# Altium schematic sheet Power.SchDoc
size A
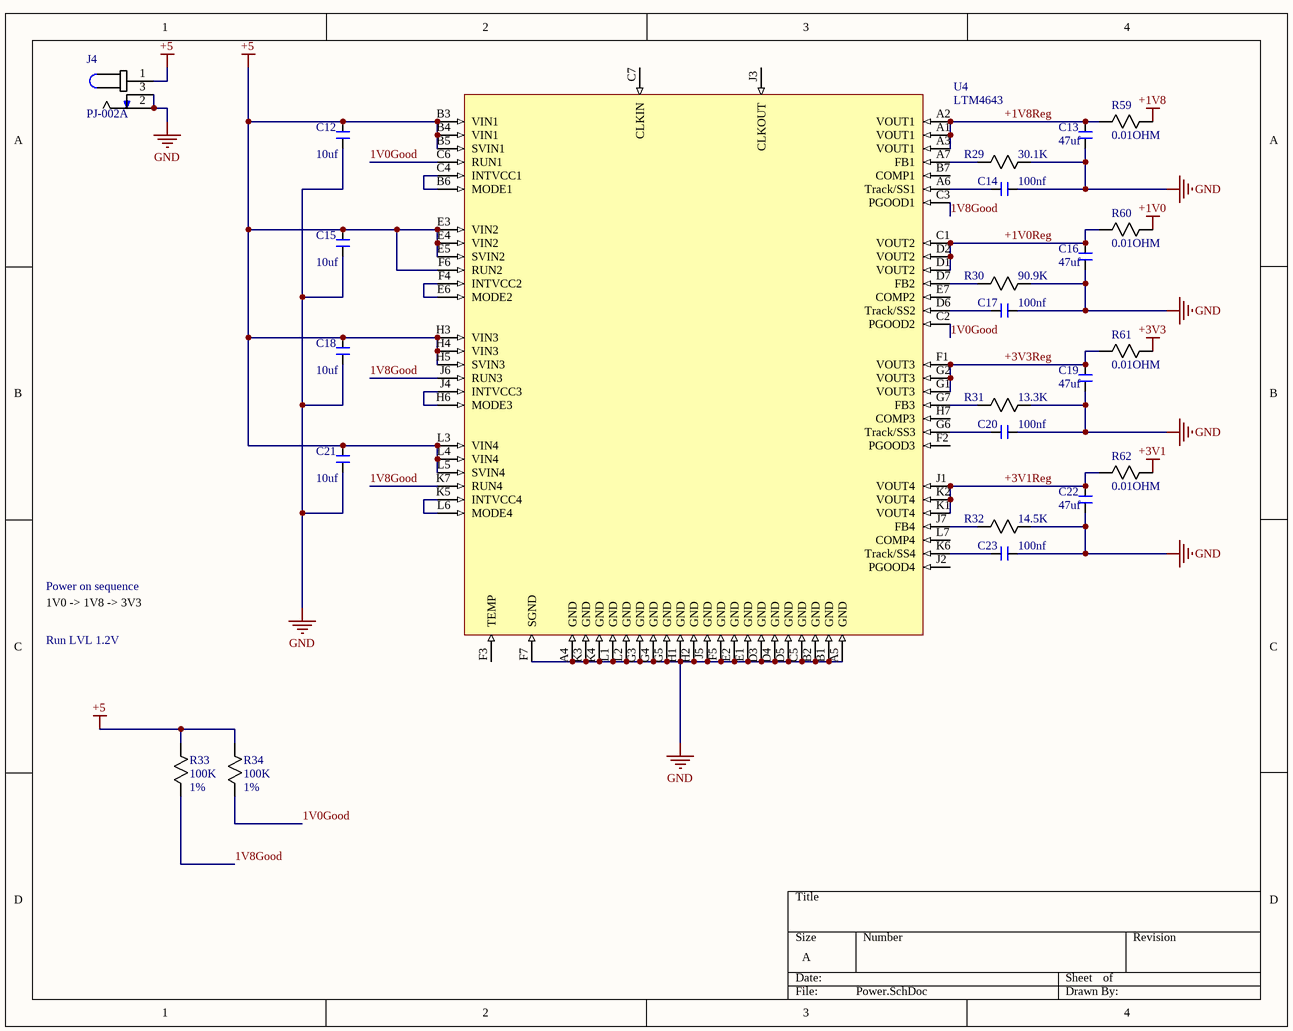
[diagram p0: Power.SchDoc]

## Parts
C12  10uf  [0402Footprint]
C13  47uf  [0805FOOTPRINT]
C14  100nf  [0402Footprint]
C15  10uf  [0402Footprint]
C16  47uf  [0805FOOTPRINT]
C17  100nf  [0402Footprint]
C18  10uf  [0402Footprint]
C19  47uf  [0805FOOTPRINT]
C20  100nf  [0402Footprint]
C21  10uf  [0402Footprint]
C22  47uf  [0805FOOTPRINT]
C23  100nf  [0402Footprint]
J4  PJ-002A  [CUI_PJ-002A]
R29  30.1K  [RES_CRCW_0402]
R30  90.9K  [RES_CRCW_0402]
R31  13.3K  [RES_CRCW_0402]
R32  14.5K  [RES_CRCW_0402]
R33  100K  Tolerance: 1%  [RES_CRCW_0402]
R34  100K  Tolerance: 1%  [RES_CRCW_0402]
R59  0.01OHM  [RESC1508X06N]
R60  0.01OHM  [RESC1508X06N]
R61  0.01OHM  [RESC1508X06N]
R62  0.01OHM  [RESC1508X06N]
U4  LTM4643  [LTM4643 15X9X2.42 05-08-1908]

## Nets
+1V0: R60.1
+1V8: R59.1
+3V1: R62.1
+3V3: R61.1
+5: C12.1 C15.1 C18.1 C21.1 J4.1 R33.1 R34.1 U4.B3(VIN1) U4.B4(VIN1) U4.B5(SVIN1) U4.E3(VIN2) U4.E4(VIN2) U4.E5(SVIN2) U4.F6(RUN2) U4.H3(VIN3) U4.H4(VIN3) U4.H5(SVIN3) U4.L3(VIN4) U4.L4(VIN4) U4.L5(SVIN4)
GND: C12.2 C13.1 C14.1 C15.2 C16.1 C17.1 C18.2 C19.1 C20.1 C21.2 C22.1 C23.1 J4.2 J4.3 R29.1 R30.1 R31.1 R32.1 U4.A4(GND) U4.A5(GND) U4.B1(GND) U4.B2(GND) U4.C5(GND) U4.D3(GND) U4.D4(GND) U4.D5(GND) U4.E1(GND) U4.E2(GND) U4.F5(GND) U4.F7(SGND) U4.G3(GND) U4.G4(GND) U4.G5(GND) U4.H1(GND) U4.H2(GND) U4.J5(GND) U4.K3(GND) U4.K4(GND) U4.L1(GND) U4.L2(GND)
1V0Good: R34.2 U4.C2(PGOOD2) U4.C6(RUN1)
1V8Good: R33.2 U4.C3(PGOOD1) U4.J6(RUN3) U4.K7(RUN4)
+1V0Reg: C16.2 R60.2 U4.C1(VOUT2) U4.D1(VOUT2) U4.D2(VOUT2)
+1V8Reg: C13.2 R59.2 U4.A1(VOUT1) U4.A2(VOUT1) U4.A3(VOUT1)
+3V1Reg: C22.2 R62.2 U4.J1(VOUT4) U4.K1(VOUT4) U4.K2(VOUT4)
+3V3Reg: C19.2 R61.2 U4.F1(VOUT3) U4.G1(VOUT3) U4.G2(VOUT3)
NetC14_2: C14.2 U4.A6(Track/SS1)
NetC17_2: C17.2 U4.D6(Track/SS2)
NetC20_2: C20.2 U4.G6(Track/SS3)
NetC23_2: C23.2 U4.K6(Track/SS4)
NetR29_2: R29.2 U4.A7(FB1)
NetR30_2: R30.2 U4.D7(FB2)
NetR31_2: R31.2 U4.G7(FB3)
NetR32_2: R32.2 U4.J7(FB4)
NetU4_B6: U4.B6(MODE1) U4.C4(INTVCC1)
NetU4_E6: U4.E6(MODE2) U4.F4(INTVCC2)
NetU4_H6: U4.H6(MODE3) U4.J4(INTVCC3)
NetU4_K5: U4.K5(INTVCC4) U4.L6(MODE4)

Not connected (* = marked no-connect by the designer): U4 B7(COMP1) C7(CLKIN) E7(COMP2) F2(PGOOD3) F3(TEMP) H7(COMP3) J2(PGOOD4) J3(CLKOUT) L7(COMP4)

## Notes on the sheet
- Power on sequence
- 1V0 -> 1V8 -> 3V3
- Run LVL 1.2V

## Library data of the parts
C12 C15 C18 C21 = 10uf_0402: 0402; Manufacturer 1: *; Manufacturer Part Number 1: *
C13 C16 C19 C22 = 47uf_0805: 0805; Manufacturer 1: *; Manufacturer Part Number 1: *
C14 C17 C20 C23 = 100nf_0402: 0402; Manufacturer 1: *; Manufacturer Part Number 1: *
J4 = PJ-002A: 2.0 mm Center Pin, 2.5 A, Right Angle, Through Hole, Dc Power Jack Connector; MF: CUI Inc.; MP: PJ-002A; Digi-Key_Part_Number: CP-002A-ND; SnapEDA_Link: https://www.snapeda.com/parts/PJ-002A/CUI%20Inc./view-part/?ref=snap; Package: None; Digi-Key_Purchase_URL: https://www.digikey.com/product-detail/en/cui-inc/PJ-002A/CP-002A-ND/96962?utm_source=snapeda&utm_medium=aggregator&utm_campaign=symbol; CUI_purchase_URL: https://www.cui.com/product/interconnect/dc-power-connectors/jacks/2.0-mm-center-pin/pj-002a?utm_source=snapeda.com&utm_medium=referral&utm_campaign=snapedaBOM; Value: *
R29 = 30.1K_0402: 0402; Tolerance: 1%; Manufacturer 1: *; Manufacturer Part Number 1: *
R30 = 90.9K_0402: 0402; Tolerance: 1%; Manufacturer 1: *; Manufacturer Part Number 1: *
R31 = 13.3K_0402: 0402; Tolerance: 1%; Manufacturer 1: *; Manufacturer Part Number 1: *
R32 = 14.5K_0402: 0402; Tolerance: 1%; Manufacturer 1: *; Manufacturer Part Number 1: *
R33 R34 = 100K_0402: 0402; Manufacturer 1: *; Manufacturer Part Number 1: *
R59-R62 = 0.01OHM_0603: 0603; Manufacturer 1: *; Manufacturer Part Number 1: *